# Altium schematic sheet Gyrometer.SchDoc
size A
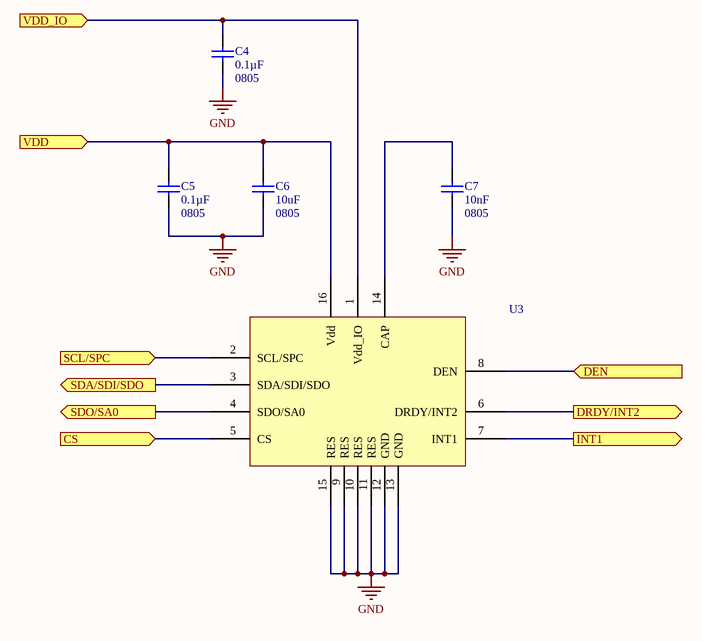
[diagram p0: Gyrometer.SchDoc]

## Parts
C4  Capacitance: 0.1µF  Package / Case: 0805  [CAP0805]  (hidden comment: C0805C104K5RACTU)
C5  Capacitance: 0.1µF  Package / Case: 0805  [CAP0805]  (hidden comment: C0805C104K5RACTU)
C6  Capacitance: 10uF  Package / Case: 0805  [CAP0805]  (hidden comment: C2012JB1V106K125AC)
C7  Capacitance: 10nF  Package / Case: 0805  [CAP0805]  (hidden comment: CGA4C2C0G1H103J060AA)
U3  L3GD20HTR  [L3GD20HTR]  (value not drawn)

## Ports
CS (in), DEN (in), DRDY/INT2 (out), INT1 (out), SCL/SPC (in), SDA/SDI/SDO (out), SDO/SA0 (out), VDD (in), VDD_IO (in)

## Nets
GND: C4.1 C5.1 C6.1 C7.1 U3.9(RES) U3.10(RES) U3.11(RES) U3.12(GND) U3.13(GND) U3.15(RES)
CS: U3.5(CS) ; port CS
DEN: U3.8(DEN) ; port DEN
DRDY/INT2: U3.6(DRDY/INT2) ; port DRDY/INT2
INT1: U3.7(INT1) ; port INT1
SCL/SPC: U3.2(SCL/SPC) ; port SCL/SPC
SDA/SDI/SDO: U3.3(SDA/SDI/SDO) ; port SDA/SDI/SDO
SDO/SA0: U3.4(SDO/SA0) ; port SDO/SA0
VDD: C5.2 C6.2 U3.16(Vdd) ; port VDD
VDD_IO: C4.2 U3.1(Vdd_IO) ; port VDD_IO
NetC7_2: C7.2 U3.14(CAP)

## Library data of the parts
C4 C5 = C0805C104K5RACTU: CAP CER 0.1UF 50V X7R 0805; Tolerance: ±10%; Supplier 1: Digi-Key; Supplier Part Number 1: 399-1170-1-ND; Voltage - Rated: 50V; Temperature Coefficient: X7R
C6 = C2012JB1V106K125AC: CAP CER 10UF 35V JB 0805; Tolerance: ±20%; Supplier 1: Digi-Key; Supplier Part Number 1: 445-11517-1-ND; Voltage - Rated: 35V
C7 = CGA4C2C0G1H103J060AA: CAP CER 10000PF 50V C0G 0805; Tolerance: ±5%; Supplier 1: Digi-Key; Supplier Part Number 1: 445-6947-1-ND; Voltage - Rated: 50V; Thickness: 0.7mm; Operating Temperature: -55°C ~ 125°C
U3 = L3GD20HTR: IC MEMS MOTION SENSOR 16LLGA; Manufacturer: STMicroelectronics; Axis: X (Pitch), Y (Roll), Z (Yaw); Range °/s: ±245, 500, 2000; Sensitivity (LSB/(°/s)): 8.75 ~ 70; Bandwidth: 6.25Hz ~ 400Hz; Output Type: I²C, SPI; Voltage - Supply: 2.2 V ~ 3.6 V; Current - Supply: 5mA; Type: Digital; Package / Case: 16-LGA; Operating Temperature: -40°C ~ 85°C (TA); Supplier 1: Digi-Key; Supplier Part Number 1: 497-13931-1-ND